# Altium schematic sheet Switching-Regulators.SchDoc
size A4; DocumentNumber: 3; SheetNumber: 3; SheetTotal: 9
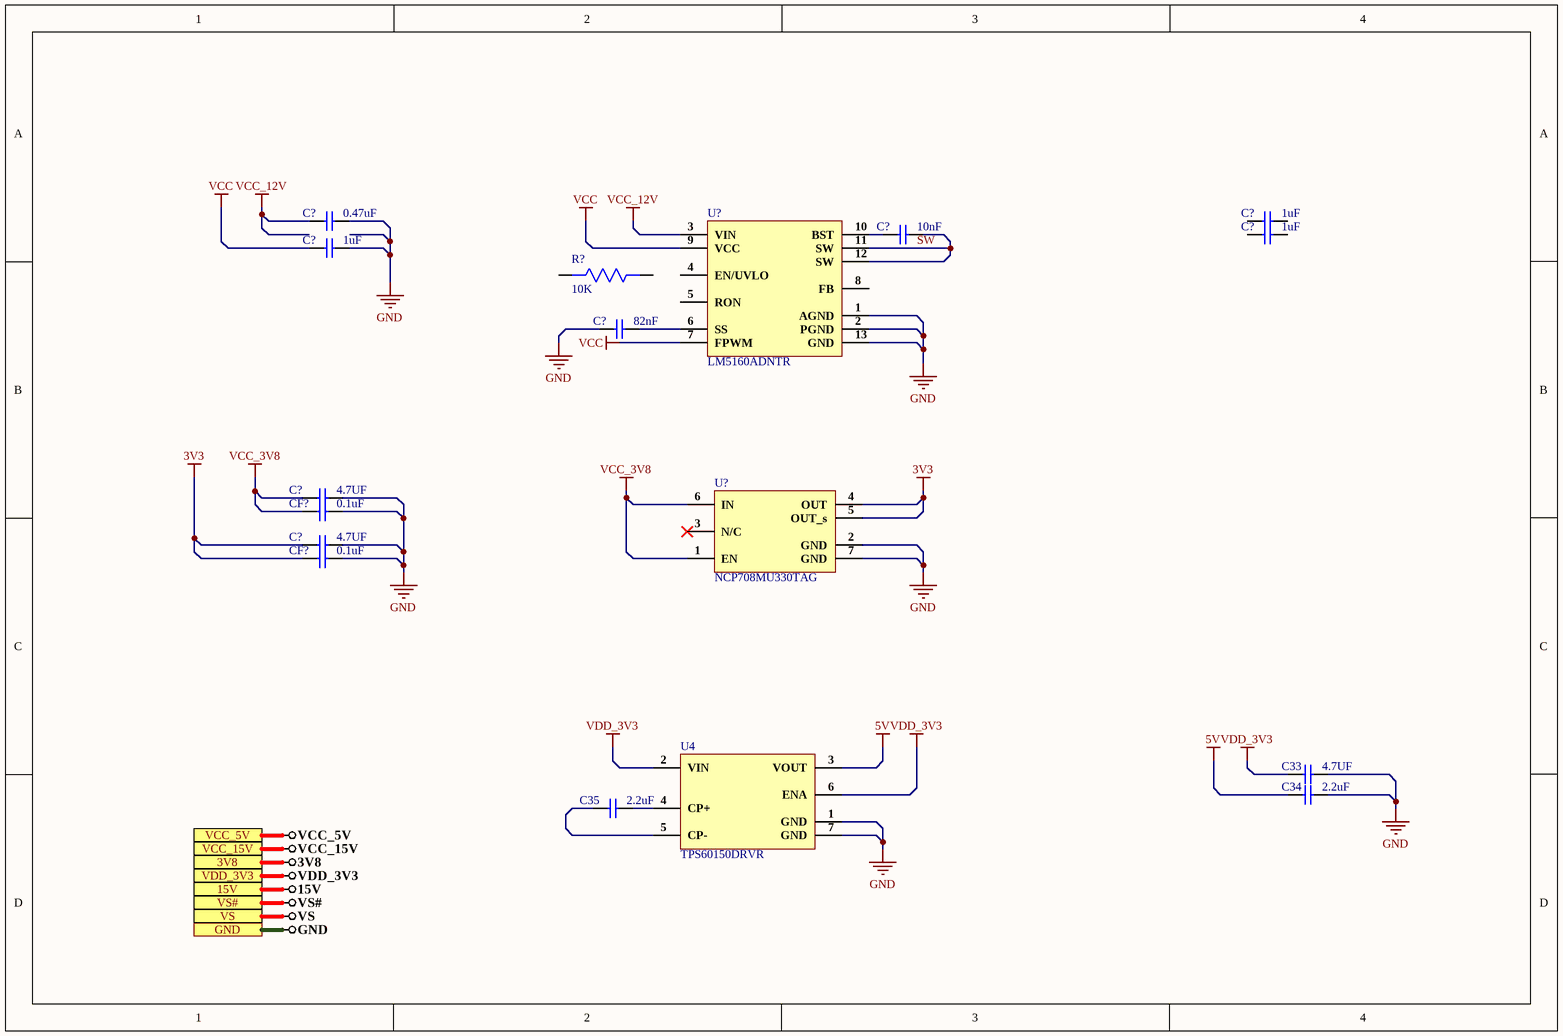
[diagram p0: Switching-Regulators.SchDoc]

## Parts
(Parts that share a designator on the sheet are numbered #1, #2 ... from top to bottom, then left to right.)
C33  4.7UF  [Cap0603]
C34  2.2uF  [Cap 0603]
C35  2.2uF  [Cap 0603]
C?#1  0.47uF  [Cap 0402]
C?#2  1uF  [Cap 0603]
C?#3  10nF  [Cap 0402]
C?#4  1uF  [Cap 0603]
C?#5  1uF  [Cap 0603]
C?#6  82nF  [Cap 0603]
C?#7  4.7UF  [Cap0603]
C?#8  4.7UF  [Cap0603]
CF?#1  0.1uF  [Cap0603]
CF?#2  0.1uF  [Cap0603]
R?  10K  [Res-0201]
U4  TPS60150DRVR  [TPS60150DRVR]
U?#1  LM5160ADNTR  [LM5160ADNTR]
U?#2  NCP708MU330TAG  [6-UDFN (3x3)]

## Ports
3V8, 15V, GND, VCC_5V, VCC_15V, VDD_3V3, VS, VS#

## Nets
3V3: C?#8.1 CF?#2.1 U?#2.4(OUT) U?#2.5(OUT_s)
3V8: port 3V8
5V: C34.1 U4.3(VOUT)
15V: port 15V
GND: C33.2 C34.2 C?#1.2 C?#5.2 C?#6.1 C?#7.2 C?#8.2 CF?#1.2 CF?#2.2 U4.1(GND) U4.7(GND) U?#1.1(AGND) U?#1.2(PGND) U?#1.13(GND) U?#2.2(GND) U?#2.7(GND) ; port GND
VCC: C?#5.1 U?#1.7(FPWM) U?#1.9(VCC)
VCC_3V8: C?#7.1 CF?#1.1 U?#2.1(EN) U?#2.6(IN)
VCC_5V: port VCC_5V
VCC_12V: C?#1.1 U?#1.3(VIN)
VCC_15V: port VCC_15V
VDD_3V3: C33.1 U4.2(VIN) U4.6(ENA) ; port VDD_3V3
VS: port VS
VS#: port VS#
SW: C?#3.2 U?#1.11(SW) U?#1.12(SW)
NetC35_1: C35.1 U4.5(CP-)
NetC35_2: C35.2 U4.4(CP+)
NetC?#3_1: C?#3.1 U?#1.10(BST)
NetC?#6_2: C?#6.2 U?#1.6(SS)

Not connected (* = marked no-connect by the designer): C?#2 1 2; C?#4 1 2; R? 1 2; U?#1 4(EN/UVLO) 5(RON) 8(FB); U?#2 3(N/C)*

## Library data of the parts
C33 C?#7 C?#8 = CL10A475KA8NQNC: CAP CER 4.7UF 25V X5R 0603; Manufacturer: Samsung; Tolerance: 10%; Supplier 1: Digi-Key; Manufacturer Part Number: CL10A475KA8NQNC; Stock 1: 2252340; Pricing 1: 1=0.37, 10=0.255, 100=0.1528, 500=0.11456, 1000=0.09675 (USD); Mount: Surface Mount; Case/Package: 0603; Case Code (Metric): 1608; Case Code (Imperial): 0603; Contact Plating: Tin; Min Operating Temperature: -55°C; Max Operating Temperature: 85°C; Package Quantity: 1; Packaging: Tape and Reel; Capacitance: 4.7uF; Voltage Rating: 25V; Dielectric: X5R; Termination: Wraparound; Length: 1.6mm; Width: 0.031inch; Thickness: 0.035inch; Depth: 0.8mm; Lead Free: Lead Free; ComponentLink1URL: http://www.samsungsem.com/kr/support/product-search/mlcc/CL10A475KA8NQNC.jsp?src-supplier=Digi-Key; ComponentLink1Description: http://www.samsungsem.com/kr/support/product-search/mlcc/CL10A475KA8NQNC.jsp?src-supplier=Digi-Key; Supplier Part Number 1: 1276-1900-1-ND
C34 C35 = GRM188R6YA225KA12D: CAP, 2.2µF, 35V, 10%, X5R, 0603; Manufacturer: Murata; Material: Ceramic; Supplier 1: Digi-Key; Manufacturer Part Number: GRM188R6YA225KA12D; RoHS: Yes; Category: Ceramic Capacitors; Stock 1: 81665; Pricing 1: 1=0.21000, 10=0.14100, 50=0.08480, 100=0.07170, 500=0.04904, 1000=0.04338 (USD); Mount: Surface Mount; Case/Package: 0603; Case Code (Metric): 1608; Case Code (Imperial): 0603; Weight: 0.000222oz; Min Operating Temperature: -55°C; Max Operating Temperature: 85°C; Package Quantity: 4000; Packaging: Tape and Reel; Capacitance: 2.2uF; Tolerance: 10%; Voltage Rating: 35V; Dielectric: X5R; Voltage: 35V; Termination: SMD/SMT; Voltage Rating (DC): 35V; Series: GRM; Length: 1.6mm; Width: 0.8mm; Height: 0.8mm; Thickness: 0.035inch; Depth: 0.8mm; REACH SVHC: No SVHC; Lead Free: Lead Free; RoHS Compliant: Yes; ComponentLink1URL: https://datasheet.ciiva.com/14906/partnumbering-e-01-14906490.pdf?src-supplier=Digi-Key; ComponentLink1Description: https://datasheet.ciiva.com/14906/partnumbering-e-01-14906490.pdf?src-supplier=Digi-Key; ComponentLink2URL: https://datasheet.ciiva.com/14906/partnumbering-e-01-14906491.pdf?src-supplier=Digi-Key; ComponentLink2Description: https://datasheet.ciiva.com/14906/partnumbering-e-01-14906491.pdf?src-supplier=Digi-Key; ComponentLink3URL: https://datasheet.ciiva.com/14906/partnumbering-e-01-14906492.pdf?src-supplier=Digi-Key; ComponentLink3Description: https://datasheet.ciiva.com/14906/partnumbering-e-01-14906492.pdf?src-supplier=Digi-Key; Supplier Part Number 1: 490-7204-1-ND
C?#1 = UMK105ABJ474KV-F: CAP CER 0.47UF 50V X5R 0402; Manufacturer: Taiyo Yuden; Capacitance: 470nF; Tolerance: 10%; Supplier 1: Digi-Key; Manufacturer Part Number: UMK105ABJ474KV-F; RoHS: Yes; Category: Ceramic Capacitors; Stock 1: 145003; Pricing 1: 1=0.24000, 10=0.16100, 50=0.09680, 100=0.08170, 500=0.05592, 1000=0.04946, 2500=0.04731, 5000=0.04301 (USD); Mount: Surface Mount; Case/Package: 0402; Case Code (Metric): 1005; Case Code (Imperial): 0402; Min Operating Temperature: -55°C; Max Operating Temperature: 85°C; Package Quantity: 10000; Packaging: Tape and Reel; Voltage Rating: 50V; Voltage Rating (DC): 50V; Dielectric: X5R; Termination: SMD/SMT; Length: 0.039inch; Width: 0.02inch; Height: 0.5mm; Thickness: 0.022inch; Lead Free: Lead Free; RoHS Compliant: Yes; ComponentLink1URL: https://datasheet.ciiva.com/30249/584umk105abj474kv-f-30249824.pdf?src-supplier=Onlinecomponents.com; ComponentLink1Description: https://datasheet.ciiva.com/30249/584umk105abj474kv-f-30249824.pdf?src-supplier=Onlinecomponents.com; ComponentLink2URL: https://datasheet.ciiva.com/24370/10umk105abj474kv-f-24370678.pdf?src-supplier=Onlinecomponents.com; ComponentLink2Description: https://datasheet.ciiva.com/24370/10umk105abj474kv-f-24370678.pdf?src-supplier=Onlinecomponents.com; ComponentLink3URL: https://datasheet.ciiva.com/18697/mlcc-all-e-18697429.pdf?src-supplier=Digi-Key; ComponentLink3Description: https://datasheet.ciiva.com/18697/mlcc-all-e-18697429.pdf?src-supplier=Digi-Key; ComponentLink4URL: https://datasheet.ciiva.com/18697/mlcc-all-e-18697430.pdf?src-supplier=Digi-Key; ComponentLink4Description: https://datasheet.ciiva.com/18697/mlcc-all-e-18697430.pdf?src-supplier=Digi-Key; ComponentLink5URL: https://datasheet.ciiva.com/18697/mlcc-all-e-18697431.pdf?src-supplier=Digi-Key; ComponentLink5Description: https://datasheet.ciiva.com/18697/mlcc-all-e-18697431.pdf?src-supplier=Digi-Key; Supplier Part Number 1: 587-3497-1-ND
C?#2 C?#4 C?#5 = CC0603KRX5R8BB105: CAP CER 1UF 25V X5R 0603; Manufacturer: Yageo; Tolerance: 10%; Supplier 1: Digi-Key; Manufacturer Part Number: CC0603KRX5R8BB105; RoHS: Yes; Category: Ceramic Capacitors; Stock 1: 919939; Pricing 1: 1=0.12000, 10=0.08400, 50=0.04760, 100=0.03940, 500=0.02764, 1000=0.02288 (USD); Mount: Surface Mount; Case/Package: 0603; Number of Pins: 2; Case Code (Metric): 1608; Case Code (Imperial): 0603; Min Operating Temperature: -55°C; Max Operating Temperature: 85°C; Capacitance: 1uF; Dielectric: X5R; Package Quantity: 1; Voltage Rating: 25V; Packaging: Tape and Reel; Termination: SMD/SMT; Voltage Rating (DC): 25V; Series: CC; Construction: Flat; Length: 1.6mm; Width: 0.031inch; Height: 0.8mm; Thickness: 0.035inch; Depth: 0.8mm; Radiation Hardening: No; REACH SVHC: No SVHC; Lead Free: Lead Free; Halogen Free: Halogen Free; RoHS Compliant: Yes; ComponentLink1URL: https://datasheet.ciiva.com/176/mlccorderingcode-176785.pdf?src-supplier=Digi-Key; ComponentLink1Description: https://datasheet.ciiva.com/176/mlccorderingcode-176785.pdf?src-supplier=Digi-Key; ComponentLink2URL: https://datasheet.ciiva.com/176/mlccorderingcode-176786.pdf?src-supplier=Digi-Key; ComponentLink2Description: https://datasheet.ciiva.com/176/mlccorderingcode-176786.pdf?src-supplier=Digi-Key; ComponentLink3URL: https://datasheet.ciiva.com/176/mlccorderingcode-176787.pdf?src-supplier=Digi-Key; ComponentLink3Description: https://datasheet.ciiva.com/176/mlccorderingcode-176787.pdf?src-supplier=Digi-Key; ComponentLink4URL: https://datasheet.ciiva.com/17436/upy-gphc-x5r-4v-to-50v-12-17436952.pdf?src-supplier=Avnet+Europe; ComponentLink4Description: https://datasheet.ciiva.com/17436/upy-gphc-x5r-4v-to-50v-12-17436952.pdf?src-supplier=Avnet+Europe; ComponentLink5URL: https://datasheet.ciiva.com/7978/1525783-7978171.pdf?src-supplier=Element14; ComponentLink5Description: https://datasheet.ciiva.com/7978/1525783-7978171.pdf?src-supplier=Element14; ComponentLink6URL: https://datasheet.ciiva.com/11586/upy-gphc-x5r-4v-to-50v-12-11586318.pdf?src-supplier=Avnet; ComponentLink6Description: https://datasheet.ciiva.com/11586/upy-gphc-x5r-4v-to-50v-12-11586318.pdf?src-supplier=Avnet; Supplier Part Number 1: 311-1445-1-ND
C?#3 = CC0402KRX7R8BB103: CAP CER 10000PF 25V X7R 0402; Manufacturer: Yageo; Tolerance: 10%; Supplier 1: Digi-Key; Manufacturer Part Number: CC0402KRX7R8BB103; Stock 1: 0; Pricing 1: 1=0.1, 10=0.021, 100=0.0093, 500=0.00666, 1000=0.00523, 2500=0.00476, 5000=0.00438 (USD); Mount: Surface Mount; Case/Package: 0402; Case Code (Metric): 1005; Case Code (Imperial): 0402; Min Operating Temperature: -55°C; Max Operating Temperature: 125°C; Capacitance: 10nF; Dielectric: X7R; Voltage Rating: 25V; Package Quantity: 1; Packaging: Tape and Reel; Voltage Rating (DC): 25V; Termination: SMD/SMT; Composition: Ceramic; Length: 1mm; Height: 0.5mm; Depth: 0.5mm; Width: 0.02inch; Thickness: 0.022inch; Radiation Hardening: No; REACH SVHC: Unknown; Lead Free: Lead Free; Halogen Free: Halogen Free; ComponentLink1URL: http://www.yageo.com/documents/recent/UPY-GPHC_X7R_6.3V-to-50V_18.pdf?src-supplier=Digi-Key; ComponentLink1Description: http://www.yageo.com/documents/recent/UPY-GPHC_X7R_6.3V-to-50V_18.pdf?src-supplier=Digi-Key; ComponentLink2URL: https://www.verical.com/server-webapp/html/getDatasheet?partID=375418&src-supplier=Verical; ComponentLink2Description: https://www.verical.com/server-webapp/html/getDatasheet?partID=375418&src-supplier=Verical; ComponentLink3URL: http://www.yageo.com/documents/recent/UPY-GPHC_X7R_6.3V-to-50V_8.pdf?src-supplier=Avnet; ComponentLink3Description: http://www.yageo.com/documents/recent/UPY-GPHC_X7R_6.3V-to-50V_8.pdf?src-supplier=Avnet; ComponentLink4URL: https://4donline.ihs.com/images/VipMasterIC/IC/YAGO/YAGO-S-A0003557223/YAGO-S-A0003557223-1.pdf?hkey=52A5661711E402568146F3353EA87419&src-supplier=Element14; ComponentLink4Description: https://4donline.ihs.com/images/VipMasterIC/IC/YAGO/YAGO-S-A0003557223/YAGO-S-A0003557223-1.pdf?hkey=52A5661711E402568146F3353EA87419&src-supplier=Element14; ComponentLink5URL: http://www.farnell.com/datasheets/2167236.pdf?src-supplier=Element14; ComponentLink5Description: http://www.farnell.com/datasheets/2167236.pdf?src-supplier=Element14; ComponentLink6URL: http://www.mouser.com/ds/2/447/Yageo_UPY-GP_NP0_16V-to-50V_9-358835.pdf?src-supplier=Mouser; ComponentLink6Description: http://www.mouser.com/ds/2/447/Yageo_UPY-GP_NP0_16V-to-50V_9-358835.pdf?src-supplier=Mouser; Supplier Part Number 1: 311-1337-1-ND
C?#6 = CC0603KRX7R9BB823: CAP CER 0.082UF 50V X7R 0603; Manufacturer: Yageo; Tolerance: 10%; Supplier 1: Newark; Manufacturer Part Number: CC0603KRX7R9BB823; RoHS: Yes; Category: Ceramic Capacitors; Stock 1: 40000; Pricing 1: 1=0.01500, 4000=0.01400, 8000=0.01400 (USD); Mount: Surface Mount; Case/Package: 0603; Case Code (Imperial): 0603; Case Code (Metric): 1608; Weight: 7.1E-05oz; Min Operating Temperature: -55°C; Max Operating Temperature: 125°C; Packaging: Tape and Reel; Capacitance: 82nF; Voltage Rating (DC): 50V; Dielectric: X7R; Voltage Rating: 50V; Termination: SMD/SMT; Resistor Type: Ceramic; Series: CC; Length: 1.6mm; Width: 0.031inch; Thickness: 0.035inch; Depth: 0.8mm; Radiation Hardening: No; Lead Free: Lead Free; Halogen Free: Halogen Free; RoHS Compliant: Yes; ComponentLink1URL: https://datasheet.ciiva.com/13264/upy-gphc-x7r-6-3v-to-50v-8-12304-13264057.pdf?src-supplier=Mouser; ComponentLink1Description: https://datasheet.ciiva.com/13264/upy-gphc-x7r-6-3v-to-50v-8-12304-13264057.pdf?src-supplier=Mouser; Supplier Part Number 1: 69AH7269
CF?#1 CF?#2 = CL10B104KB8NNNC: Cap Ceramic 0.1uF 50VDC X7R 10% SMD 0603 Paper T/R; Manufacturer: Samsung; Capacitance: 100nF; Voltage Rating: 50V; Supplier 1: Digi-Key; Manufacturer Part Number: CL10B104KB8NNNC; RoHS: Yes; Category: Ceramic Capacitors; Stock 1: 3998791; Pricing 1: 1=0.10000, 10=0.03000, 50=0.01640, 100=0.01340, 500=0.00954, 1000=0.00750 (USD); Mount: Surface Mount; Case/Package: 0603; Case Code (Metric): 1608; Case Code (Imperial): 0603; Material: Ceramic; Contact Plating: Tin; Min Operating Temperature: -55°C; Max Operating Temperature: 125°C; Dielectric: X7R; Tolerance: 10%; Package Quantity: 1; Packaging: Tape and Reel; Voltage: 50V; Voltage Rating (DC): 50V; Series: CL; Construction: Flat; Length: 1.6mm; Width: 0.031inch; Height: 0.8mm; Depth: 0.8mm; Thickness: 0.035inch; Radiation Hardening: No; Lead Free: Lead Free; RoHS Compliant: Yes; ComponentLink1URL: https://datasheet.ciiva.com/25803/cl10b104kb8nnnc-25803393.pdf?src-supplier=Digi-Key; ComponentLink1Description: https://datasheet.ciiva.com/25803/cl10b104kb8nnnc-25803393.pdf?src-supplier=Digi-Key; ComponentLink2URL: https://datasheet.ciiva.com/26838/getdatasheetpartid-89097-26838411.pdf?src-supplier=Verical; ComponentLink2Description: https://datasheet.ciiva.com/26838/getdatasheetpartid-89097-26838411.pdf?src-supplier=Verical; ComponentLink3URL: https://datasheet.ciiva.com/29198/456651-da-01-en-vs-kondensator-0605-29198839.pdf?src-supplier=Conrad; ComponentLink3Description: https://datasheet.ciiva.com/29198/456651-da-01-en-vs-kondensator-0605-29198839.pdf?src-supplier=Conrad; Supplier Part Number 1: 1276-1000-1-ND
R? = RC0201FR-0710KL: RES SMD 10K OHM 1% 1/20W 0201; Manufacturer: Yageo; Resistance: 10kR; Temperature Coefficient: 200ppm/°C; Power Rating: 50mW; Voltage Rating: 25V; Supplier 1: Digi-Key; Manufacturer Part Number: RC0201FR-0710KL; Stock 1: 12729696; Pricing 1: 1=0.1, 10=0.042, 100=0.0171, 1000=0.00768, 2500=0.00666, 5000=0.00551 (USD); Case/Package: 0201; Number of Pins: 2; Weight: 6E-06oz; Contact Plating: Tin,Matte; Case Code (Imperial): 0201; Case Code (Metric): 0603; Min Operating Temperature: -55°C; Max Operating Temperature: 125°C; Tolerance: 1%; Composition: Thick Film; Packaging: Tape and Reel; Package Quantity: 1; Termination: SMD/SMT; Number of Terminations: 2; Military Standard: Not; Max Power Dissipation: 50mW; Voltage Rating (DC): 25V; Working Voltage: 25V; Features: Moisture Resistant; Length: 0.6mm; Height: 0.01inch; Width: 0.3mm; Depth: 0.3mm; Radiation Hardening: No; REACH SVHC: No SVHC; Lead Free: Lead Free; ComponentLink1URL: http://www.yageo.com/documents/recent/PYu-RC_Group_51_RoHS_L_10.pdf?src-supplier=Digi-Key; ComponentLink1Description: http://www.yageo.com/documents/recent/PYu-RC_Group_51_RoHS_L_10.pdf?src-supplier=Digi-Key; ComponentLink2URL: http://www.farnell.com/datasheets/2167052.pdf?src-supplier=Element14; ComponentLink2Description: http://www.farnell.com/datasheets/2167052.pdf?src-supplier=Element14; ComponentLink3URL: http://www.yageo.com/documents/recent/PYu-RC0201_51_RoHS_L_8.pdf?src-supplier=Avnet; ComponentLink3Description: http://www.yageo.com/documents/recent/PYu-RC0201_51_RoHS_L_8.pdf?src-supplier=Avnet; ComponentLink4URL: http://www.yageo.com/documents/recent/PYu-RC0201_51_RoHS_L_8.pdf?src-supplier=Avnet+Europe; ComponentLink4Description: http://www.yageo.com/documents/recent/PYu-RC0201_51_RoHS_L_8.pdf?src-supplier=Avnet+Europe; ComponentLink5URL: https://www.verical.com/server-webapp/html/getDatasheet?partID=421074&src-supplier=Verical; ComponentLink5Description: https://www.verical.com/server-webapp/html/getDatasheet?partID=421074&src-supplier=Verical; ComponentLink6URL: http://www.farnell.com/datasheets/1421516.pdf?src-supplier=Element14; ComponentLink6Description: http://www.farnell.com/datasheets/1421516.pdf?src-supplier=Element14; Supplier Part Number 1: 311-10.0KMCT-ND
U4 = TPS60150DRVR: IC REG CHARGE PUMP 5V 140MA 6SON; Manufacturer: Texas Instruments; Number of Outputs: 1; Max Input Voltage: 5.5V; Min Input Voltage: 2.7V; Switching Frequency: 1.5MHz; Synchronous Rectifier: No; Min Output Voltage: 4.8V; Quiescent Current: 4.7mA; Max Output Voltage: 5.2V; Output Type: Fixed; Nominal Supply Current: 90uA; Topology: Boost; Supplier 1: Digi-Key; Manufacturer Part Number: TPS60150DRVR; RoHS: Yes; Category: Voltage Regulators - Switching; Pricing 1: 1=1.69000, 10=1.51400, 25=1.42840, 100=1.21700, 250=1.14268, 500=0.99984, 1000=0.94325 (USD); Case/Package: SON; Number of Pins: 6; Contact Plating: Gold; Min Operating Temperature: -40°C; Max Operating Temperature: 85°C; Packaging: Tape and Reel; Output Voltage: 5V; Output Current: 140mA; Package Quantity: 1; Max Output Current: 140mA; Series: -; Max Supply Voltage: 5.5V; Min Supply Voltage: 2.7V; Nominal Output Voltage: 5V; Supply Current: 90uA; Radiation Hardening: No; REACH SVHC: No SVHC; Lead Free: Lead Free; RoHS Compliant: Yes; ComponentLink1URL: https://datasheet.ciiva.com/15114/getdatasheetpartid-358100-15114131.pdf?src-supplier=Verical; ComponentLink1Description: https://datasheet.ciiva.com/15114/getdatasheetpartid-358100-15114131.pdf?src-supplier=Verical; ComponentLink2URL: https://datasheet.ciiva.com/4874/slvs888b-120916-4874885.pdf?src-supplier=Mouser; ComponentLink2Description: https://datasheet.ciiva.com/4874/slvs888b-120916-4874885.pdf?src-supplier=Mouser; ComponentLink3URL: https://datasheet.ciiva.com/26902/tps60150drvr-26902693.pdf?src-supplier=IIIC; ComponentLink3Description: https://datasheet.ciiva.com/26902/tps60150drvr-26902693.pdf?src-supplier=IIIC; ComponentLink4URL: https://datasheet.ciiva.com/41462/001014874-da-01-en-ic-reg-switched-tps60150drvr-wson-6-tid-41462718.pdf?src-supplier=Conrad; ComponentLink4Description: https://datasheet.ciiva.com/41462/001014874-da-01-en-ic-reg-switched-tps60150drvr-wson-6-tid-41462718.pdf?src-supplier=Conrad; ComponentLink5URL: https://datasheet.ciiva.com/22669/1828381-22669637.pdf?src-supplier=Element14; ComponentLink5Description: https://datasheet.ciiva.com/22669/1828381-22669637.pdf?src-supplier=Element14; ComponentLink6URL: https://datasheet.ciiva.com/2025/tps60150-2025302.pdf?src-supplier=Digi-Key; ComponentLink6Description: https://datasheet.ciiva.com/2025/tps60150-2025302.pdf?src-supplier=Digi-Key; ComponentLink7URL: https://datasheet.ciiva.com/2025/tps60150-2025303.pdf?src-supplier=Digi-Key; ComponentLink7Description: https://datasheet.ciiva.com/2025/tps60150-2025303.pdf?src-supplier=Digi-Key; ComponentLink8URL: https://datasheet.ciiva.com/2025/tps60150-2025304.pdf?src-supplier=Digi-Key; ComponentLink8Description: https://datasheet.ciiva.com/2025/tps60150-2025304.pdf?src-supplier=Digi-Key; ComponentLink9URL: https://datasheet.ciiva.com/46382/1828381-46382472.pdf?src-supplier=Element14; ComponentLink9Description: https://datasheet.ciiva.com/46382/1828381-46382472.pdf?src-supplier=Element14; ComponentLink10URL: https://datasheet.ciiva.com/3215/tps60150-3215851.pdf?src-supplier=Avnet; ComponentLink10Description: https://datasheet.ciiva.com/3215/tps60150-3215851.pdf?src-supplier=Avnet; ComponentLink11URL: https://datasheet.ciiva.com/14320/tps60150-14320303.pdf?src-supplier=Avnet; ComponentLink11Description: https://datasheet.ciiva.com/14320/tps60150-14320303.pdf?src-supplier=Avnet; Supplier Part Number 1: 296-24054-6-ND
U?#1 = LM5160ADNTR: IC REG BUCK FLYBCK ADJ 12WSON; Manufacturer: Texas Instruments; Number of Outputs: 1; Min Input Voltage: 4.5V; Max Input Voltage: 65V; Min Output Voltage: 2V; Max Output Voltage: 60V; Output Current: 1.5A; Switching Frequency: 1MHz; Synchronous Rectifier: Yes; Quiescent Current: 2.3mA; Topology: Flyback; Output Type: Adjustable; Supplier 1: Digi-Key; Manufacturer Part Number: LM5160ADNTR; RoHS: Yes; Category: Power Supply Modules; Pricing 1: 1=5.87000, 10=5.27300, 25=4.98480, 100=4.32000, 250=4.09848, 500=3.67756 (USD); Mount: Surface Mount; Min Operating Temperature: -40°C; Max Operating Temperature: 125°C; Packaging: Tape and Reel; Lead Free: Lead Free; RoHS Compliant: Yes; ComponentLink1URL: http://www.ti.com/lit/ds/symlink/lm5160a.pdf?src-supplier=Digi-Key; ComponentLink1Description: http://www.ti.com/lit/ds/symlink/lm5160a.pdf?src-supplier=Digi-Key; ComponentLink2URL: http://www.ti.com/general/docs/suppproductinfo.tsp?distId=10&amp;gotoUrl=http%3A%2F%2Fwww.ti.com%2Flit%2Fgpn%2Flm5160a&src-supplier=Digi-Key; ComponentLink2Description: http://www.ti.com/general/docs/suppproductinfo.tsp?distId=10&amp;gotoUrl=http%3A%2F%2Fwww.ti.com%2Flit%2Fgpn%2Flm5160a&src-supplier=Digi-Key; Supplier Part Number 1: 296-46121-6-ND
U?#2 = NCP708MU330TAG: IC REG LINEAR 3.3V 1A 6UDFN; Manufacturer: ON Semiconductor; Dropout Voltage: 220mV; Number of Regulators: 1; Min Current Limit: 1.1A; Supplier 1: Digi-Key; Manufacturer Part Number: NCP708MU330TAG; RoHS: Yes; Category: Voltage Regulators - Linear; Stock 1: 3000; Pricing 1: 1=0.51000, 10=0.43500, 25=0.40600, 100=0.32470, 250=0.30152, 500=0.25512, 1000=0.19714 (USD); Mount: Surface Mount; Min Operating Temperature: -40°C; Max Operating Temperature: 125°C; Packaging: Tape and Reel; Output Voltage: 3.3V; Output Current: 1A; Lead Free: Lead Free; RoHS Compliant: Yes; ComponentLink1URL: http://www.mouser.com/ds/2/308/NCP708-D-1082570.pdf?src-supplier=Mouser; ComponentLink1Description: http://www.mouser.com/ds/2/308/NCP708-D-1082570.pdf?src-supplier=Mouser; ComponentLink2URL: http://www.onsemi.com/pub/Collateral/NCP708-D.PDF?src-supplier=Digi-Key; ComponentLink2Description: http://www.onsemi.com/pub/Collateral/NCP708-D.PDF?src-supplier=Digi-Key; Supplier Part Number 1: NCP708MU330TAGOSCT-ND